# Altium project monitorHolter2.PrjPcb (part 2 of 2)

## Sheet Digitalización.SchDoc: Iot Holter Monitor - Digitalización
size 400 x 299 mm; SheetNumber: 6
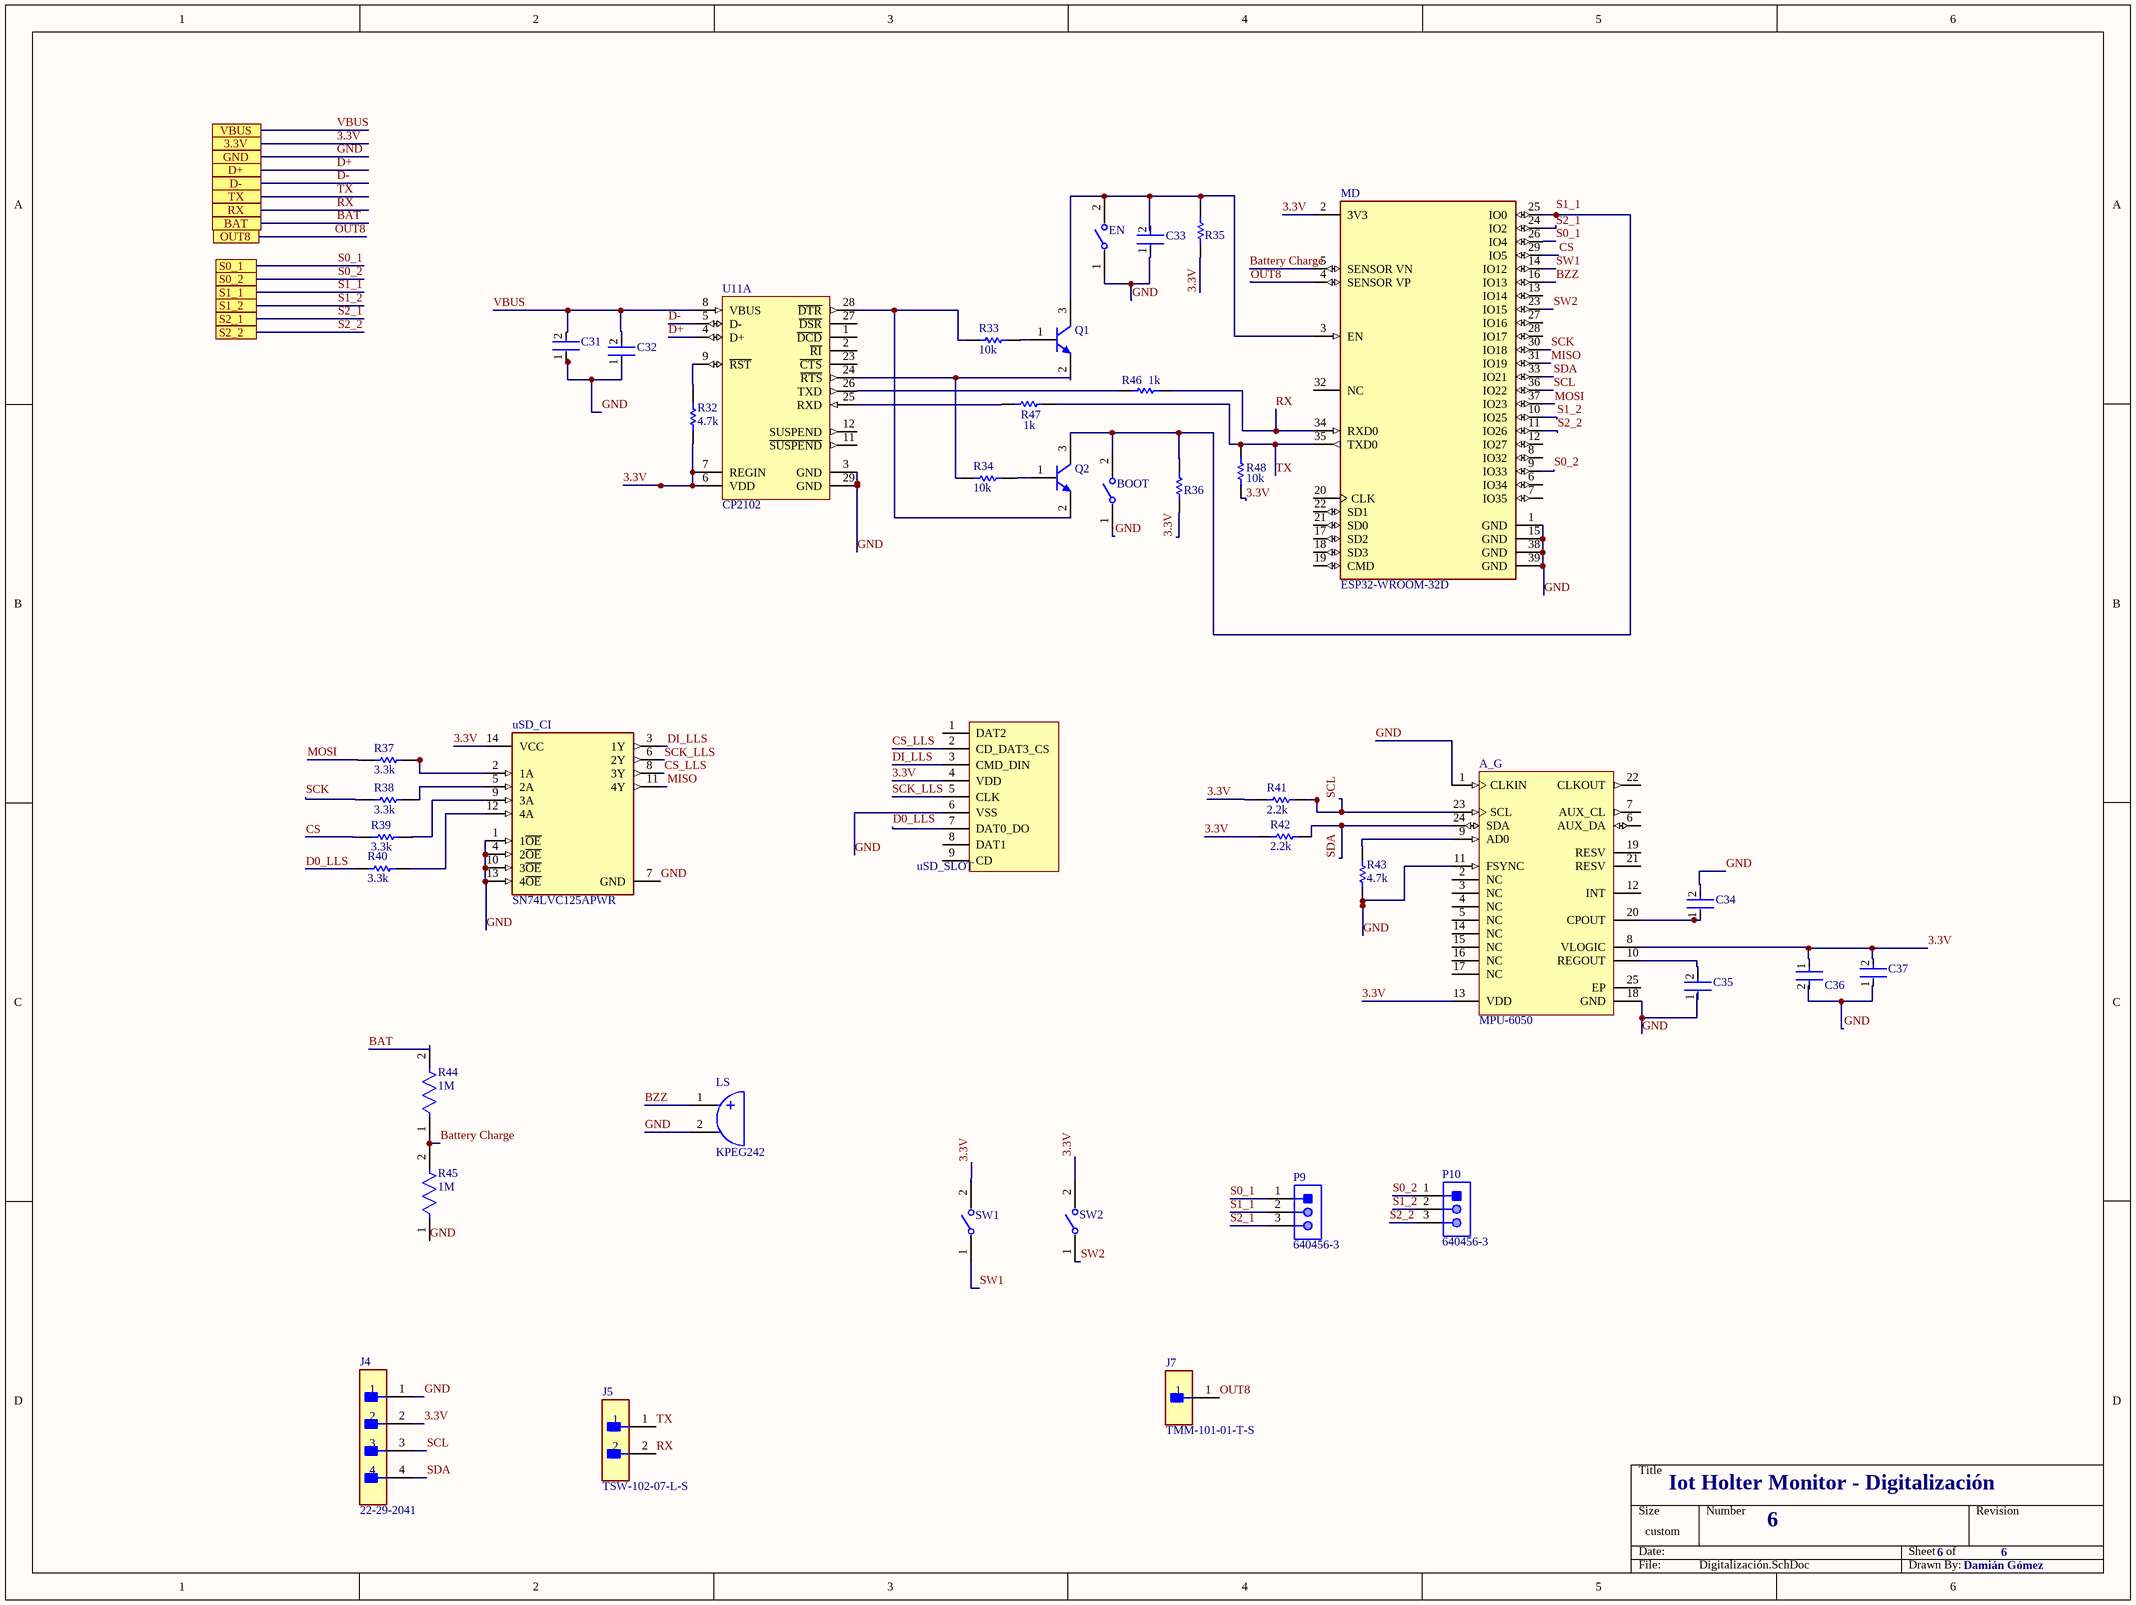
[diagram p5: Digitalización.SchDoc]

### Parts
A_G  MPU-6050  [IS-QFN-24_V]
BOOT  B3U-1000P  [FP-B3U-1000P-MFG]  (value not drawn)
C31  GRM2165C1H332JA01D  [FP-GRM216-0_1-IPC_B]  (value not drawn)
C32  GRM2165C1H332JA01D  [FP-GRM216-0_1-IPC_B]  (value not drawn)
C33  GRM2165C1H332JA01D  [FP-GRM216-0_1-IPC_B]  (value not drawn)
C34  GRM2165C1H332JA01D  [FP-GRM216-0_1-IPC_B]  (value not drawn)
C35  GRM2165C1H332JA01D  [FP-GRM216-0_1-IPC_B]  (value not drawn)
C36  10uF  [FP-CL31-IPC_C]  (value not drawn)
C37  GRM2165C1H332JA01D  [FP-GRM216-0_1-IPC_B]  (value not drawn)
EN  B3U-1000P  [FP-B3U-1000P-MFG]  (value not drawn)
J4  22-29-2041  [FP-22-29-2041-MFG]
J5  TSW-102-07-L-S  [FP-TSW-102-07-L-S-MFG]
J7  TMM-101-01-T-S  [FP-TMM-101-01-T-S-MFG]
LS  KPEG242  [KINGS-KPEG242-2]
MD  ESP32-WROOM-32D  [FP-ESP32-WROOM-32D-MFG]
P9  640456-3  [TECO-640456-3]
P10  640456-3  [TECO-640456-3]
Q1  MMBTA42LT1G  [ONSC-SOT-23-3-318-08_V]  (value not drawn)
Q2  MMBTA42LT1G  [ONSC-SOT-23-3-318-08_V]  (value not drawn)
R32  4.7k  [RESC2013X50X30LL20T20]
R33  10k  [RESC2013X50X30LL20T20]
R34  10k  [RESC2013X50X30LL20T20]
R35  10k  [RESC2013X50X30LL20T20]  (value not drawn)
R36  10k  [RESC2013X50X30LL20T20]  (value not drawn)
R37  3.3k  [RESC2013X50X30LL20T20]
R38  3.3k  [RESC2013X50X30LL20T20]
R39  3.3k  [RESC2013X50X30LL20T20]
R40  3.3k  [RESC2013X50X30LL20T20]
R41  2.2k  [RESC2013X50X30LL20T20]
R42  2.2k  [RESC2013X50X30LL20T20]
R43  4.7k  [RESC2013X50X30LL20T20]
R44  1M  [FP-RC3216-MFG]
R45  1M  [FP-RC3216-MFG]
R46  1k  [RESC2013X50X30LL20T20]
R47  1k  [RESC2013X50X30LL20T20]
R48  10k  [RESC2013X50X30LL20T20]
SW1  B3U-1000P  [FP-B3U-1000P-MFG]  (value not drawn)
SW2  B3U-1000P  [FP-B3U-1000P-MFG]  (value not drawn)
U11  CP2102  [SLAB-QFN-28-3125x3125TP_M]  (part A of 2)
uSD_CI  SN74LVC125APWR  [FP-PW0014A-IPC_B]
uSD_SLOT  uSD_TFP09-2-12BComponent_1  [TF09-2-12B]  (value not drawn)

### Ports
3.3V, BAT, D+, D-, GND, OUT8, RX, S0_1, S0_2, S1_1, S1_2, S2_1, S2_2, TX, VBUS

### Nets
GND: A_G.1(CLKIN) A_G.11(FSYNC) A_G.18(GND) BOOT.1 C31.1 C32.1 C33.1 C34.2 C35.1 C36.2 C37.1 EN.1 J4.1 LS.2 MD.1(GND) MD.15(GND) MD.38(GND) MD.39(GND) R43.1 R45.1 U11.3(GND) U11.29(GND) uSD_CI.1(1~{OE}) uSD_CI.4(2~{OE}) uSD_CI.7(GND) uSD_CI.10(3~{OE}) uSD_CI.13(4~{OE}) uSD_SLOT.6(VSS) ; port GND
VBUS: C31.2 C32.2 U11.8(VBUS) ; port VBUS
3.3V: A_G.8(VLOGIC) A_G.13(VDD) C36.1 C37.2 J4.2 MD.2(3V3) R32.1 R35.1 R36.1 R41.1 R42.1 R48.1 SW1.2 SW2.2 U11.6(VDD) U11.7(REGIN) uSD_CI.14(VCC) uSD_SLOT.4(VDD) ; port 3.3V
BAT: R44.2 ; port BAT
Battery Charge: MD.5(SENSOR_VN) R44.1 R45.2
BZZ: LS.1 MD.16(IO13)
CS: MD.29(IO5) R39.1
CS_LLS: uSD_CI.8(3Y) uSD_SLOT.2(CD_DAT3_CS)
D0_LLS: R40.1 uSD_SLOT.7(DAT0_DO)
D+: U11.4(D+) ; port D+
D-: U11.5(D-) ; port D-
DI_LLS: uSD_CI.3(1Y) uSD_SLOT.3(CMD_DIN)
MISO: MD.31(IO19) uSD_CI.11(4Y)
MOSI: MD.37(IO23) R37.1
OUT8: J7.1 MD.4(SENSOR_VP) ; port OUT8
RX: J5.2 MD.34(RXD0) R46.2 ; port RX
S0_1: MD.26(IO4) P9.1 ; port S0_1
S0_2: MD.9(IO33) P10.1 ; port S0_2
S1_1: BOOT.2 MD.25(IO0) P9.2 Q2.3(C) R36.2 ; port S1_1
S1_2: MD.10(IO25) P10.2 ; port S1_2
S2_1: MD.24(IO2) P9.3 ; port S2_1
S2_2: MD.11(IO26) P10.3 ; port S2_2
SCK: MD.30(IO18) R38.1
SCK_LLS: uSD_CI.6(2Y) uSD_SLOT.5(CLK)
SCL: A_G.23(SCL) J4.3 MD.36(IO22) R41.2
SDA: A_G.24(SDA) J4.4 MD.33(IO21) R42.2
SW1: MD.14(IO12) SW1.1
SW2: MD.23(IO15) SW2.1
TX: J5.1 MD.35(TXD0) R47.2 R48.2 ; port TX
NetA_G_9: A_G.9(AD0) R43.2
NetA_G_10: A_G.10(REGOUT) C35.2
NetA_G_20: A_G.20(CPOUT) C34.1
NetC33_2: C33.2 EN.2 MD.3(EN) Q1.3(C) R35.2
NetQ1_1: Q1.1(B) R33.2
NetQ1_2: Q1.2(E) R34.1 U11.24(~{RTS})
NetQ2_1: Q2.1(B) R34.2
NetQ2_2: Q2.2(E) R33.1 U11.28(~{DTR})
NetR32_2: R32.2 U11.9(~{RST})
NetR37_2: R37.2 uSD_CI.2(1A)
NetR38_2: R38.2 uSD_CI.5(2A)
NetR39_2: R39.2 uSD_CI.9(3A)
NetR40_2: R40.2 uSD_CI.12(4A)
NetR46_1: R46.1 U11.26(TXD)
NetR47_1: R47.1 U11.25(RXD)

Not connected (* = marked no-connect by the designer): A_G 2(NC) 3(NC) 4(NC) 5(NC) 6(AUX_DA) 7(AUX_CL) 12(INT) 14(NC) 15(NC) 16(NC) 17(NC) 19(RESV) 21(RESV) 22(CLKOUT) 25(EP); MD 6(IO34) 7(IO35) 8(IO32) 12(IO27) 13(IO14) 17(SD2) 18(SD3) 19(CMD) 20(CLK) 21(SD0) 22(SD1) 27(IO16) 28(IO17) 32(NC); U11 1(~{DCD}) 2(~{RI}) 11(~{SUSPEND}) 12(SUSPEND) 23(~{CTS}) 27(~{DSR}); uSD_SLOT 1(DAT2) 8(DAT1) 9(CD)

### Notes on the sheet
- Iot Holter Monitor - Digitalización
- 6
- Damián Gómez

### Library data of the parts
A_G = CMP-1753-00002-2: 3-Axis Gyroscope, Accelerometer and a Digital Motion Processor(TM) (DMP), 2.375 to 3.46 V, -40 to 85 degC, 24-Pin QFN, RoHS, Tape and Reel; Manufacturer: InvenSense; Featured Product: MPU-60506-Axis,IntegratedI²CSolution; Other Names: 1428-1007-2 / MPU6050; Sensor Type: MotionTracking; Online Catalog: MPU-6000™Series; Unit PriceUSD: Digital; Datasheet Version: Rev. 3.3, 05/2012; Category: Sensors,Transducers; Datasheet URL: http://datasheet.octopart.com/MPU-6050-InvenSense-datasheet-14421344.pdf; Family: Multifunction; Standard Package: 5,000; Manufacturer URL: http://www.invensense.com/; Output Type: Digital; Dynamic Catalog: MPU-6000™Series
BOOT EN SW1 SW2 = CMP-2100-03586-2: SWITCH TACTILE SPST-NO 0.05A 12V; Contact Resistance: 100mR; Operating Force: 1.5N; Max Current Rating: 50mA; Switch Travel: 0.15mm; Actuator Type: Standard; Mechanical Life: 200000Cycles; Ratings: Dust Proof; Illumination Type: Non-Illuminated; Throw Configuration: SPST; Actuator Length: 0.4mm; Switch Function: Off-Mom; Height: 1.2mm; Width: 3mm; Weight: 0.000776oz; Contact Material: Silver; Max Voltage Rating (DC): 12V; Insulation Resistance: 100MR; Lead Free: Lead Free; Current Rating: 50mA; Termination: SMD/SMT; Length: 4mm; Voltage Rating (DC): 12V; Contact Current Rating: 50mA; Orientation: Straight; Depth: 2.5mm; Max Operating Temperature: 70°C; Packaging: Tape and Reel; Min Operating Temperature: -25°C; Package Quantity: 1; Mount: Surface Mount; Electrical Life: 200000Cycles
C31-C35 C37 = CMP-2007-00889-2: Chip Multilayer Ceramic Capacitors for General Purpose, 0805, 3300pF, C0G, 30ppm/°C, 5%, 50V; Insulation Resistance: 10GR; Capacitance: 3.3nF; Mount: Surface Mount; Case/Package: 0805; Case Code (Imperial): 0805; Lead Free: Lead Free; RoHS Compliant: Yes; Dielectric: C0G; Material: Ceramic; Size: 0.6mm; Voltage Rating (DC): 50V; Voltage: 50V; Termination: SMD/SMT; Case Code (Metric): 2012; Construction: Flat; Max Operating Temperature: 125°C; Series: GRM; Min Operating Temperature: -55°C; Temperature Coefficient: 30ppm/°C; Packaging: Tape and Reel; Height: 0.6mm; REACH SVHC: No SVHC; Width: 0.049inch; Length: 2mm; Thickness: 0.028inch; Voltage Rating: 50V; Tolerance: 5%; Number of Pins: 2; Package Quantity: 1; Dielectric Material: Ceramic; Depth: 1.25mm
C36 = CMP-13271-001211-1: Cap Ceramic 10uF 500V C0G ±5% SMD 1206 +125°C Embossed T/R; Capacitance: 220pF; Tolerance: 5%; Voltage Rating (DC): 500V; Depth: 1.6mm; Max Operating Temperature: 125°C; Width: 0.063inch; Radiation Hardening: No; Thickness: 0.055inch; Packaging: Tape and Reel; Height: 1.25mm; Case/Package: 1206; Package Quantity: 10000; Dielectric: C0G; Mount: Surface Mount; Voltage Rating: 500V; Min Operating Temperature: -55°C; Length: 3.2mm
J4 = CMP-04776-000366-1: CONN HEADER VERT 4POS 2.54MM; Insulation Resistance: 50GR; Voltage Rating: 250V; Glow Wire Compliant: Non-compliant; Max Current Rating: 4A; Number of Circuits: 4; Contact Resistance: 10mR; Gender: Male; Number of Lines: 1; Length: 10.16mm; Radiation Hardening: No; Pitch: 2.54mm; Contact Material: Brass; Height: 11.7mm; Max Operating Temperature: 75°C; Flammability Rating: UL94 V-0; Mount: Through Hole; Voltage Rating (DC): 250V; Halogen Free: Low Halogen; Housing Color: White; Package Quantity: 1500; Series: KK® 6410; Number of Rows: 1; Housing Material: Nylon; Depth: 5.8mm; RoHS Compliant: Yes; Orientation: Straight; Contact Gender: Male; Color: Natural; Current Rating: 4A; Contact Mating Length: 0.295inch; Number of Poles: 4; Packaging: Bulk; Contact Type: Male Pin; Termination: Solder; Number of Positions: 4; Number of Contacts: 4; Lead Free: Lead Free; Min Operating Temperature: 0°C; Fastening Type: Friction; Contact Plating: Gold
J5 = CMP-02766-001428-1: CONN HEADER VERT 2POS 2.54MM; Voltage Rating: 550V; Current Rating: 7.6A; Gender: Male; Number of Contacts: 2; Connector Type: Male Pin; Radiation Hardening: No; Orientation: Straight; Contact Plating: Gold; Max Operating Temperature: 125°C; Mount: Through Hole; Package Quantity: 1; Number of Rows: 1; Housing Material: Polyester; RoHS Compliant: Yes; Length: 5.08mm; Max Voltage Rating (AC): 550V; Pitch: 2.54mm; Packaging: Bulk; Depth: 2.54mm; Termination: Solder; Min Operating Temperature: -55°C; Housing Color: Black; Lead Free: Lead Free; Color: Black; Number of Positions: 2; Width: 2.54mm; Max Current Rating: 7.6A; REACH SVHC: No SVHC; Contact Material: Bronze; Contact Mating Length: 0.23inch; Series: TSW; Contact Type: Male Pin
J7 = CMP-02766-001504-1: CONN HEADER VERT 1POS; Number of Positions: 1; Gender: Male; Lead Free: Lead Free; Contact Plating: Tin; Insulation Color: Black; Max Operating Temperature: 105°C; Connector Type: Header; Radiation Hardening: No; Packaging: Bulk; Contact Material: Bronze; Contact Shape: Square; Min Operating Temperature: -55°C; Contact Type: Male Pin; Insulation Material: Polymer; Series: TMM; Contact Finish - Mating: TIN; Fastening Type: Pull; Number of Rows: 1; Number of Contacts: 1; REACH SVHC: No SVHC; Mount: Through Hole; Termination: Solder
LS = CMP-2000-06518-1: Piezo Indicator, 4100 Hz, 3 to 16 V, -20 to 70 degC, 2-Pin THD, RoHS; PartNumber: KPE-242; Manufacturer: KingstateElectronicsCorp.; Frequency Range: 3600to4600Hz; Maximum Supply Current: 7mA; Typical Operating Supply Voltage: 12Vdc; Product Height: 7.6mm; Current - Max: 7A; Tone Mode: Continuous; Product Diameter: 13.7mm; Minimum Sound Pressure: 70dBA; Maximum Resonant Frequency: 4600Hz; Type: Indicator; Datasheet URL: https://datasheet.ciiva.com/11776/0900766b8068f3a2-11776713.pdf; Mounting: ThroughHole; Technology: Piezo; Operating Temperature: -20to70°C; Category: AudioIndicatorsandAlerts; Termination Method: Pin; Manufacturer URL: http://www.kingstate.com.tw/index.php/en/; Package Description: 2-Pin Through Hole Device, Body Dia 13.7 mm, Pitch 7.62 mm; Datasheet Version: 01/2006; Package Reference: KPEG242; Mounting Technology: ThroughHole
MD = CMP-194065-000003-1: WIFI MODULE 32MBITS SPI FLASH; Manufacturer: Espressif Systems; Max Supply Voltage: 3.6V; Nominal Supply Current: 500mA; Max Frequency: 2484MHz; Number Of Adc Channels: 16; Number Of Gpio: 32; Interface: I2C,SPI,UART,Ethernet,I2S,Other; Data Rate: 150Mbits/s; Min Supply Voltage: 3V; Bandwidth: 72MHz; Sensitivity: -98dBm; Octopart: https://octopart.com/esp32-wroom-32d-espressif+systems-91040050; Package: ESP32-WROOM-32D; ComponentLink2URL: https://www.espressif.com/sites/default/files/documentation/esp32-wroom-32d_esp32-wroom-32u_datasheet_en.pdf; Lead Free: Yes; Category: UNK; Mouser Description: Wi-Fi/BT BLE Module ESP32-D0WD, SPI Flash, UART, P; Device Class L1: Integrated Circuits (ICs); RoHS: TRUE; Temperature Range Low: -40°C; ComponentLink2Description: Datasheet; Digikey Description: WIFI MODULE 32MBITS SPI FLASH; Height: 3.2mm; Temperature: -40°C to +85°C; Manufacturer Part Number: ESP32-WROOM-32D; Device Class L3: Transceivers; Device Class L2: RF Semiconductors and Devices; Temperature Range High: +85°C; Automotive: No
P9 P10 = CMP-2000-05418-1: Male Header, Pitch 2.54 mm, 1 x 3 Position, Height 10.03 mm, Tail Length 3.56 mm, -55 to 105 degC; Manufacturer: TE Connectivity; Agency Approvals: CSA,UL; Angle: Straight; Number of Positions: 3; Standards: RoHSCompliant,ELVCompliant,UL94V-0; Current, Rating: 5 / A; Connector Type: MTA-100; Mount Angle: Vertical; Material, Housing: Polyester; Temperature, Operating: -55to+105 / degC; Voltage, Rating: 250 / V; Color, Housing: White; Contact Centerline Spacing: 0.100 / in.; Special Features: Pinstrip; Material, Contact: CopperAlloy; Contact Termination Area Plating: Tin; Primary Type: InterconnectSystem; Pin Spacing: 0.1 / "; Brand/Series: MTA-100Series; Mounting Hole Size: 0.04 / "; Manufacturer URL: http://www.te.com/; Datasheet URL: https://datasheet.ciiva.com/16456/eng-ds-82056-mta-0608-16456886.pdf; Flammability Rating: UL94V-0; Mounting Type: PCMount; Contact Mating Area Plating: Tin; Datasheet Version: Jun-08; Number of Rows: 1; Termination: Solder; Type: PCBPlug; Length, Pin: 0.14 / "; Color: White; Contact Plating: Tin; Contact Shape: Square; Number of Contacts: 3; Size, Post: 0.025 / in.; Length, Terminal Post: 0.14 / in.; Length, Overall: 0.3 / "
Q1 Q2 = CMP-1048-00662-1: High Voltage Transistor, NPN Silicon, 3-Pin SOT-23, Pb-Free, Tape and Reel; Manufacturer: On Semiconductor; fT Min (MHz): 50; IC Continuous (A): 0.5; ComponentLink1URL: http://www.onsemi.com/; ComponentLink3URL: http://www.onsemi.cn/pub_link/Collateral/318-08.PDF; RoHS: TRUE; ComponentLink2Description: Datasheet; PartNumber: MMBTA42LT1G; Polarity: NPN; DatasheetVersion: Rev. 12; PackageReference: SOT-23-3-318-08; PackageDescription: 3-Pin Small Outline Transistor, Body 2.92 x 1.3 mm, Pitch 0.95 mm; ComponentLink3Description: Package Specification; ComponentLink1Description: Manufacturer URL; Packing: Tape and Reel; PackageVersion: Rev. AP, 11/2009; Mounting Technology: Surface Mount; ComponentLink2URL: http://www.onsemi.cn/pub_link/Collateral/MMBTA42LT1-D.PDF
R32-R43 R46-R48 = CMP-2001-04896-1: Manufacturer: Vishay Dale; Part Number: CRCW08050000Z0EA
R44 R45 = CMP-13261-001932-1: Res Thick Film 1206 20kΩ 5% 0.25W ±100ppm/°C Molded SMD T/R; Max Power Dissipation: 250mW; Resistance: 1kR; Voltage Rating (DC): 200V; Width: 0.063inch; Length: 0.126inch; Min Operating Temperature: -55°C; Packaging: Tape and Reel; Case Code (Metric): 3216; Contact Plating: Tin; Composition: Thick Film; Military Standard: Not; Depth: 1.6mm; Lead Free: Lead Free; Height: 0.026inch; Case Code (Imperial): 1206; Number of Terminations: 2; Radiation Hardening: No; Case/Package: 1206; Features: Moisture Resistant; Power Rating: 250mW; Max Operating Temperature: 155°C; Tolerance: 5%; Temperature Coefficient: 100ppm/°C
U11 = CMP-2000-04924-1: Single-Chip USB to URAT Bridge, 3.3 V, -40 to 85 degC, 28-Pin QFN, RoHS, Tape and Reel; Manufacturer: Silicon Labs; Interface Circuit Standard 1: RS-232; Transmitter and Receiver FIFO Counter: No; Supply Current: 26mA; Operating Supply Voltage (Min): 3V; Operating Supply Voltage (Typ): 3.3V; Data Rate: 1000kbps; Operating Supply Voltage (Max): 3.6V; Number of Channels: 1; Package URL: http://www.silabs.com/Support%20Documents/TechnicalDocs/C8051T61x.pdf; Operating Temperature (Max): 85C; Datasheet URL: http://www.mouser.com/ds/2/368/CP2102-9-247052.pdf; Operating Temperature Classification: Industrial; Operating Temperature (Min): -40C; Package Description: 28-Pin Quad-Flat No-Leads Package, Body 5 x 5 mm, Pitch 0.5 mm; Manufacturer URL: http://www.silabs.com/; Rad Hardened: No; Package Reference: QFN-28; Pin Count: 28; Packaging: TapeandReel; Mounting: SurfaceMount; Package Type: QFNEP; Datasheet Version: Rev. 1.6, 12/2013
uSD_CI = CMP-0440-00179-4: IC BUF NON-INVERT 3.6V 14TSSOP; Max Power Dissipation: 500mW; Number of Bits per Element: 1; Number of Bits: 4; Quiescent Current: 1uA; Min Supply Voltage: 1.65V; Propagation Delay: 4.6ns; High Level Output Current: -24mA; Logic Function: Buffer; Low Level Output Current: 24mA; Polarity: Non-Inverting; Turn-On Delay Time: 5.3ns; Number of Output Lines: 3; Mount: Surface Mount; Lead Free: Lead Free; Number of Outputs: 4; Max Supply Voltage: 3.6V; Packaging: Tape and Reel; Radiation Hardening: No; Number of Channels: 4; REACH SVHC: No SVHC; Length: 5mm; Number of Elements: 4; Contact Plating: Gold; Case/Package: TSSOP; Number of Input Lines: 4; Number of Inputs: 4; Height: 1.15mm; Number of Circuits: 4; Termination: SMD/SMT; Min Operating Temperature: -40°C; Package Quantity: 1; Number of Gates: 4; Max Operating Temperature: 125°C; Width: 4.4mm; Number of Pins: 14

## Nets that join several sheets
GND: Alimentacion (30 pins), Adquisicion de señal y preamplificacion (32 pins), Filtrado y amplificación (5 pins), Acondicionamiento de la señal (POT8.3 POT9.3 U10.10), Digitalización (28 pins)
VBUS: Alimentacion (J1.1 R1.2), Digitalización (C31.2 C32.2 U11.8)
3.3V: Alimentacion (6 pins), Digitalización (18 pins)
5V: Alimentacion (8 pins), Adquisicion de señal y preamplificacion (13 pins), Filtrado y amplificación (U9.4 U10.4)
-5V: Alimentacion (C10.2 P11.3 U3.5), Adquisicion de señal y preamplificacion (9 pins), Filtrado y amplificación (U9.11 U10.11)
BAT: Alimentacion (C2.2 J2.1 SW_ON_OFF.2 U1.5), Digitalización (R44.2)
D+: Alimentacion (J1.3), Digitalización (U11.4)
D-: Alimentacion (J1.2), Digitalización (U11.5)
OUT1: Adquisicion de señal y preamplificacion (U8.6), Filtrado y amplificación (C22.1 C23.1)
OUT5: Filtrado y amplificación (R29.2 U10.1), Acondicionamiento de la señal (U10.5)
OUT8: Acondicionamiento de la señal (J6.1 U10.13 U10.14), Digitalización (J7.1 MD.4)
S0_1: Adquisicion de señal y preamplificacion (MUX1.10 P6.1), Digitalización (MD.26 P9.1)
S0_2: Adquisicion de señal y preamplificacion (MUX2.10 P7.1), Digitalización (MD.9 P10.1)
S1_1: Adquisicion de señal y preamplificacion (MUX1.11 P6.2), Digitalización (5 pins)
S1_2: Adquisicion de señal y preamplificacion (MUX2.11 P7.2), Digitalización (MD.10 P10.2)
S2_1: Adquisicion de señal y preamplificacion (MUX1.14 P6.3), Digitalización (MD.24 P9.3)
S2_2: Adquisicion de señal y preamplificacion (MUX2.14 P7.3), Digitalización (MD.11 P10.3)